# Altium schematic sheet MechanicalLayout-LogitechG502.schdoc
size 209 x 297 mm; Symbol: Sheet-Symbol_A3; Company: 嘉立创EDA; Version: V1.0; Page Size: A4; @Project Name: G502主板; @Page Count: 1; @Update Date: 2026-08-18; @Create Date: 2026-08-18; @Schematic Name: Schematic1; @Page No: 1; @Page Name: P1; Device: Sheet-Symbol_A3; Border: 1; Title Block Position: 4; Width: 825; Height: 1170; Region Start: 1; X Region Count: 6; Y Region Count: 4; Blade Width: 10; @Board Name: MechanicalLayout-LogitechG502
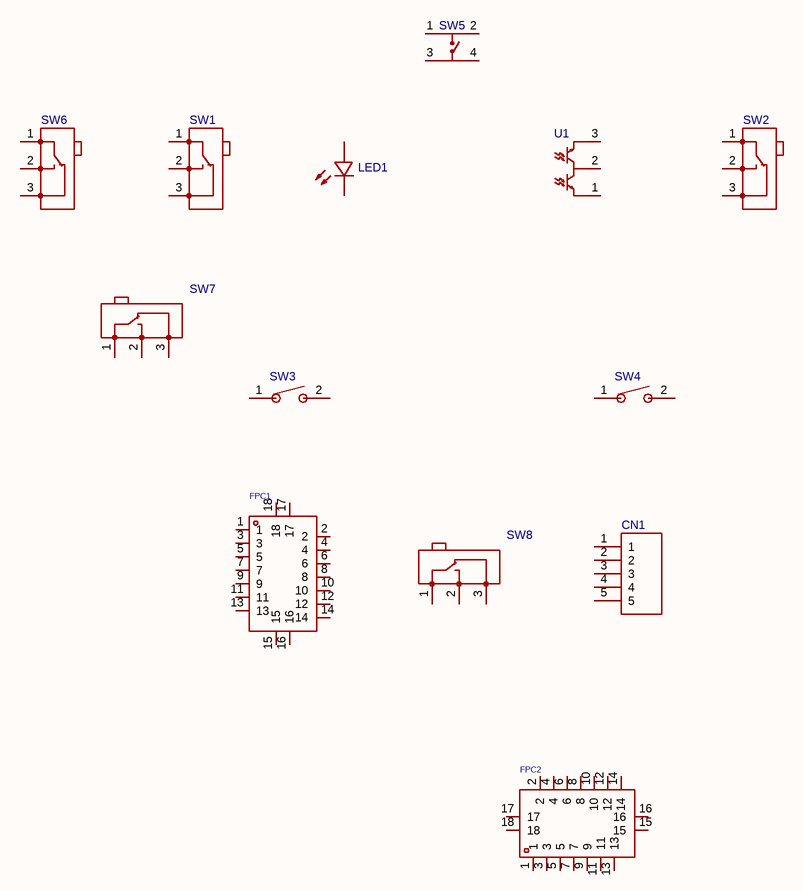
[diagram p0: MechanicalLayout-LogitechG502.schdoc]

## Parts
CN1  PH-5AWD  [CONN-TH_5P-P2.00_PH-5AWD]  (value not drawn)
FPC1  FPC-0.5AZD2-14PLCR5-H42  [FPC-SMD_14P-P1.00_FPC-0.5AZD2-14PLCR5-H42]  (value not drawn)
FPC2  FPC-0.5AZD2-14PLCR5-H42  [FPC-SMD_14P-P1.00_FPC-0.5AZD2-14PLCR5-H42]  (value not drawn)
LED1  XL-IR928-6C  [LED-TH_L4.6-W2.5-P2.54_IR928-6C]  (value not drawn)
SW1  D2F-F  [SW-TH_D2F-F]  (value not drawn)
SW2  D2F-F  [SW-TH_D2F-F]  (value not drawn)
SW3  HX TS6673Z2J JYSB  [SW-TH_L6.2-W6.2-P5.00]  (value not drawn)
SW4  HX TS6673Z2J JYSB  [SW-TH_L6.2-W6.2-P5.00]  (value not drawn)
SW5  K2-1824SR-B4SW-06  [SW-SMD_4P-L4.5-W4.5-P3.50-LS5.0]  (value not drawn)
SW6  D2F-F  [SW-TH_D2F-F]  (value not drawn)
SW7  D2F-F  [SW-TH_D2F-F]  (value not drawn)
SW8  D2F-F  [SW-TH_D2F-F]  (value not drawn)
U1  PT2559B/L2/H2(A5)  [OPTO-TH_3P_PT2559B]  (value not drawn)

## Nets

Not connected (* = marked no-connect by the designer): CN1 1 2 3 4 5; FPC1 1 2 3 4 5 6 7 8 9 10 11 12 13 14 15 16 17 18; FPC2 1 2 3 4 5 6 7 8 9 10 11 12 13 14 15 16 17 18; LED1 1(-) 2(+); SW1 1 2 3; SW2 1 2 3; SW3 1 2; SW4 1 2; SW5 1 2 3 4; SW6 1 2 3; SW7 1 2 3; SW8 1 2 3; U1 1(E(A)) 2(C(COM)) 3(E(B))

## Library data of the parts
CN1 = PH-5AWD: 插针结构:1x5P;间距:2mm;安装方式:弯插;参考系列:PH;总PIN数:5P;排数:1;每排PIN数:5;行距:-;额定电流:2A;触头材质:-;触头镀层:-;工作温度:-25℃~+85℃;; Manufacturer: BOOMELE(博穆精密); 3D Model: 991924ba749f4a71b91ce1bdbe3c00c50819f05c4eef4c71ace90d822a990e87; 3D Model Transform: 472.44,303.149,0,0,0,0,0,100.394,-137.795; Pins Structure: 1x5P; Pitch: 2mm; Reference Series: PH; Number of PINs Per Row: 5; Current Rating: 2A; Voltage Rating: 250V; Z-Height of the Board: 4.7mm; X-Length of Bottom Edge on Board (Spacing Line): 10.7mm; Y-Width of Bottom Edge on Board: 6mm; AddInBom: yes; Symbol: PH-5AWD; Device: PH-5AWD; LCSC Part Name: 1x5P 间距:2mm 弯插 系列:PH; Supplier Part: C69152; Manufacturer Part: PH-5AWD; Supplier Footprint: 弯插,P=2mm; JLCPCB Part Class: Extended Part; Datasheet: https://item.szlcsc.com/datasheet/PH-5AWD/70265.html; Supplier: LCSC; Mounting Type: 弯插; Number of Pins: 5P; Number of Rows: 1; Row Spacing: -; Contact Material: -; Contact Plating: -; Operating Temperature: -25℃~+85℃; Plastic Material: -; Flame Retardant Rating: -; Supplementary Features: -; Color: 白色; ConvertToPcb: yes; FootprintName: CONN-TH_5P-P2.00_PH-5AWD; ModelName: CONN-TH_5P-P2.00_PH-5AWD
FPC1 FPC2 = FPC-0.5AZD2-14PLCR5-H42: 锁定特性:无锁;触点类型:单侧触点/垂直;触点数量:14P;间距:0.5mm;安装方式:立贴;工作温度:-40℃~+85℃;; Manufacturer: XUNPU(讯普); Locking Feature: 无锁; Number of Contacts: 14P; Pitch: 0.5mm; FFC, FCB Thickness: 0.3mm; Rated Voltage (Max): 50V; Current Rating (Max): 500mA; AddInBom: yes; Symbol: FPC-0.5AZD2-14PLCR5-H42; Device: FPC-0.5AZD2-14PLCR5-H42; LCSC Part Name: 无锁 单侧触点/垂直 P数:14P 间距:0.5mm; Supplier Part: C54796630; Manufacturer Part: FPC-0.5AZD2-14PLCR5-H42; Supplier Footprint: SMD,P=0.5mm(交错脚); JLCPCB Part Class: Extended Part; Datasheet: https://item.szlcsc.com/datasheet/FPC-0.5AZD2-14PLCR5-H42/58238201.html; Supplier: LCSC; Contact Type: 单侧触点/垂直; Mounting Type: 立贴; Height Above Board: 4.22mm; Contact Material: 磷青铜; Contact Plating: 锡; Operating Temperature: -40℃~+85℃; ConvertToPcb: yes; FootprintName: FPC-SMD_14P-P1.00_FPC-0.5AZD2-14PLCR5-H42
LED1 = XL-IR928-6C: 正向压降(Vf):1.2V;耗散功率(Pd):75mW;波长:940nm;辐射强度(Ie):-;正向电流(If):50mA;直流反向耐压(Vr):5V;视角:40°;; Manufacturer: XINGLIGHT(成兴光); Voltage - Forward(Vf): 1.2V; Pd - Power Dissipation: 75mW; Wavelength: 940nm; Current - DC Forward(If): 50mA; Voltage - DC Reverse(Vr): 5V; Viewing Angle: 40°; Half wave width: 45nm; AddInBom: yes; Symbol: XL-IR928-6C; Device: XL-IR928-6C; LCSC Part Name: 红外940nm发射二极管; Supplier Part: C51900920; Manufacturer Part: XL-IR928-6C; Supplier Footprint: 插件; JLCPCB Part Class: Extended Part; Datasheet: https://item.szlcsc.com/datasheet/XL-IR928-6C/54589081.html; Supplier: LCSC; Radiant Intensity: -; Operating Temperature: -25℃~+85℃; ConvertToPcb: yes; FootprintName: LED-TH_L4.6-W2.5-P2.54_IR928-6C
SW1 SW2 SW6-SW8 = D2F-F: 电路结构:单刀双掷;额定电流(DC):500mA;额定电压(DC):30V;额定电流(AC):1A;额定电压(AC):125V;工作寿命:100万次;; Manufacturer: OMRON(欧姆龙); 3D Model: ae4ea62333a9487790254bc670d4b3990819f05c4eef4c71ace90d822a990e87; 3D Model Transform: 503.936,228.346,0,0,0,0,0,0,-137.795; Circuit: 单刀双掷; Actuator Style: 针状按钮; Current Rating (DC): 500mA; Voltage Rating (DC): 30V; Current Rating (AC): 1A; Voltage Rating (AC): 125V; Life: 100万次; Operating Height: 5.5mm; AddInBom: yes; ModelName: SW-TH_D2F-F-L12.8-W5.8-H7.5-P5.08; Symbol: D2F-F; Device: D2F-F; LCSC Part Name: D2F-F/微动开关; Supplier Part: C87496; Manufacturer Part: D2F-F; Supplier Footprint: 插件; JLCPCB Part Class: Extended Part; Datasheet: https://item.szlcsc.com/datasheet/D2F-F/88674.html; Supplier: LCSC; Length: 12.8mm; Width: 5.8mm; Switch Height: -; Termination Style: PC引脚; Operating Temperature: -40℃~+85℃; ConvertToPcb: yes; FootprintName: SW-TH_D2F-F
SW3 SW4 = HX TS6673Z2J JYSB: 电路结构:单刀单掷;按钮形状:圆形按钮;作用力:70gf;安装方式:直插;开关长度:6.2mm;开关宽度:6.2mm;开关高度:7.3mm;带支架:不带支架;触点电流:50mA;额定电压:12V;带灯:无;工作寿命:10万次;; Manufacturer: hanxia(韩下); 3D Model: 0f97bbcdaef84833aec76d0d29ec3eed0819f05c4eef4c71ace90d822a990e87; 3D Model Transform: 244.094,255.905,0,0,0,0,0,5.906,-137.795; Circuit: 单刀单掷; Actuator Style: 圆形按钮; Operating Force: 70gf; Switch Height: 7.3mm; with Bracket: 不带支架; Contact Current: 50mA; Voltage Rating: 12V; Actuator/Cap Color: 红色; With Lamp: 无; Life: 10万次; AddInBom: yes; Symbol: HX TS6673Z2J JYSB; Device: HX TS6673Z2J JYSB; LCSC Part Name: 静音鼠标专用开关 高寿命 无声按键; Supplier Part: C25168850; Manufacturer Part: HX TS6673Z2J JYSB; Supplier Footprint: 插件,6.2x6.2mm; JLCPCB Part Class: Extended Part; Datasheet: https://item.szlcsc.com/datasheet/HX%2520TS6673Z2J%2520JYSB/26898592.html; Supplier: LCSC; Mounting Type: 直插; Length: 6.2mm; Width: 6.2mm; IP Rating: -; Termination Style: PC引脚; Operating Temperature: -20℃~+80℃; ConvertToPcb: yes; FootprintName: SW-TH_L6.2-W6.2-P5.00; ModelName: SW-TH_L6.2-W6.2-P5.00
SW5 = K2-1824SR-B4SW-06: 电路结构:单刀单掷;按钮形状:圆形按钮;作用力:2.5N;安装方式:立贴;开关长度:4.5mm;开关宽度:4.5mm;开关高度:0.55mm;触点电流:50mA;额定电压:12V;带灯:-;工作寿命:10万次;; Manufacturer: 韩国韩荣; 3D Model: 02746cc4495247fb995f21856c53d98b0819f05c4eef4c71ace90d822a990e87; 3D Model Transform: 190.9445,177.165,0,0,0,0,0,0,0; Circuit: 单刀单掷; Actuator Style: 圆形按钮; Operating Force: 2.5N; Switch Height: 0.55mm; Contact Current: 50mA; Voltage Rating: 12V; Life: 10万次; AddInBom: yes; Symbol: K2-1824SR-B4SW-06; Device: K2-1824SR-B4SW-06; LCSC Part Name: 薄膜开关 4.5mm*4.5mm*0.55mm 250G; Supplier Part: C128938; Manufacturer Part: K2-1824SR-B4SW-06; Supplier Footprint: SMD-4P,4.5x4.5mm; JLCPCB Part Class: Extended Part; Datasheet: https://item.szlcsc.com/datasheet/K2-1824SR-B4SW-06/140224.html; Supplier: LCSC; Mounting Type: 立贴; Length: 4.5mm; Width: 4.5mm; With Lamp: -; Operating Temperature: -25℃~+85℃; ConvertToPcb: yes; FootprintName: SW-SMD_4P-L4.5-W4.5-P3.50-LS5.0; ModelName: SW-SMD_4P-L4.5-W4.5-P3.50-LS5.0
U1 = PT2559B/L2/H2(A5): 晶体管类型:NPN;集电极-发射极电压(Vceo):30V;集电极电流-Ic:-;最大功耗:75mW;集电极暗电流:100nA;峰值波长:-;; Manufacturer: EVERLIGHT(亿光); 3D Model: 74e353c5e6904c5c9aa71976a76f031b0819f05c4eef4c71ace90d822a990e87; 3D Model Transform: 219.6846,110.236,0,0,0,0,0,5.906,-196.85; Transistor Type: NPN; Collector Emitter Voltage: 30V; Dissipation Power(Max): 75mW; Collector Dark Current: 100nA; AddInBom: yes; Symbol: PT2559B/L2/H2(A5); Device: PT2559B/L2/H2(A5); LCSC Part Name: NPN光电三极管; Supplier Part: C385311; Manufacturer Part: PT2559B/L2/H2(A5); Supplier Footprint: 插件,P=2.54mm; JLCPCB Part Class: Extended Part; Datasheet: https://atta.szlcsc.com/upload/public/pdf/source/20190611/C385311_1B7C609038A8223A82540BB75A615687.pdf; Supplier: LCSC; Collector Current (Ic): -; Peak Wavelength: -; Viewing Angle: -; Operating Temperature: -25℃~+85℃; ConvertToPcb: yes; FootprintName: OPTO-TH_3P_PT2559B; ModelName: OPTO-TH_3P_PT2559B